# Altium schematic sheet MCU, Relays & USB.SchDoc
size A4; SheetNumber: 4; SheetTotal: 4
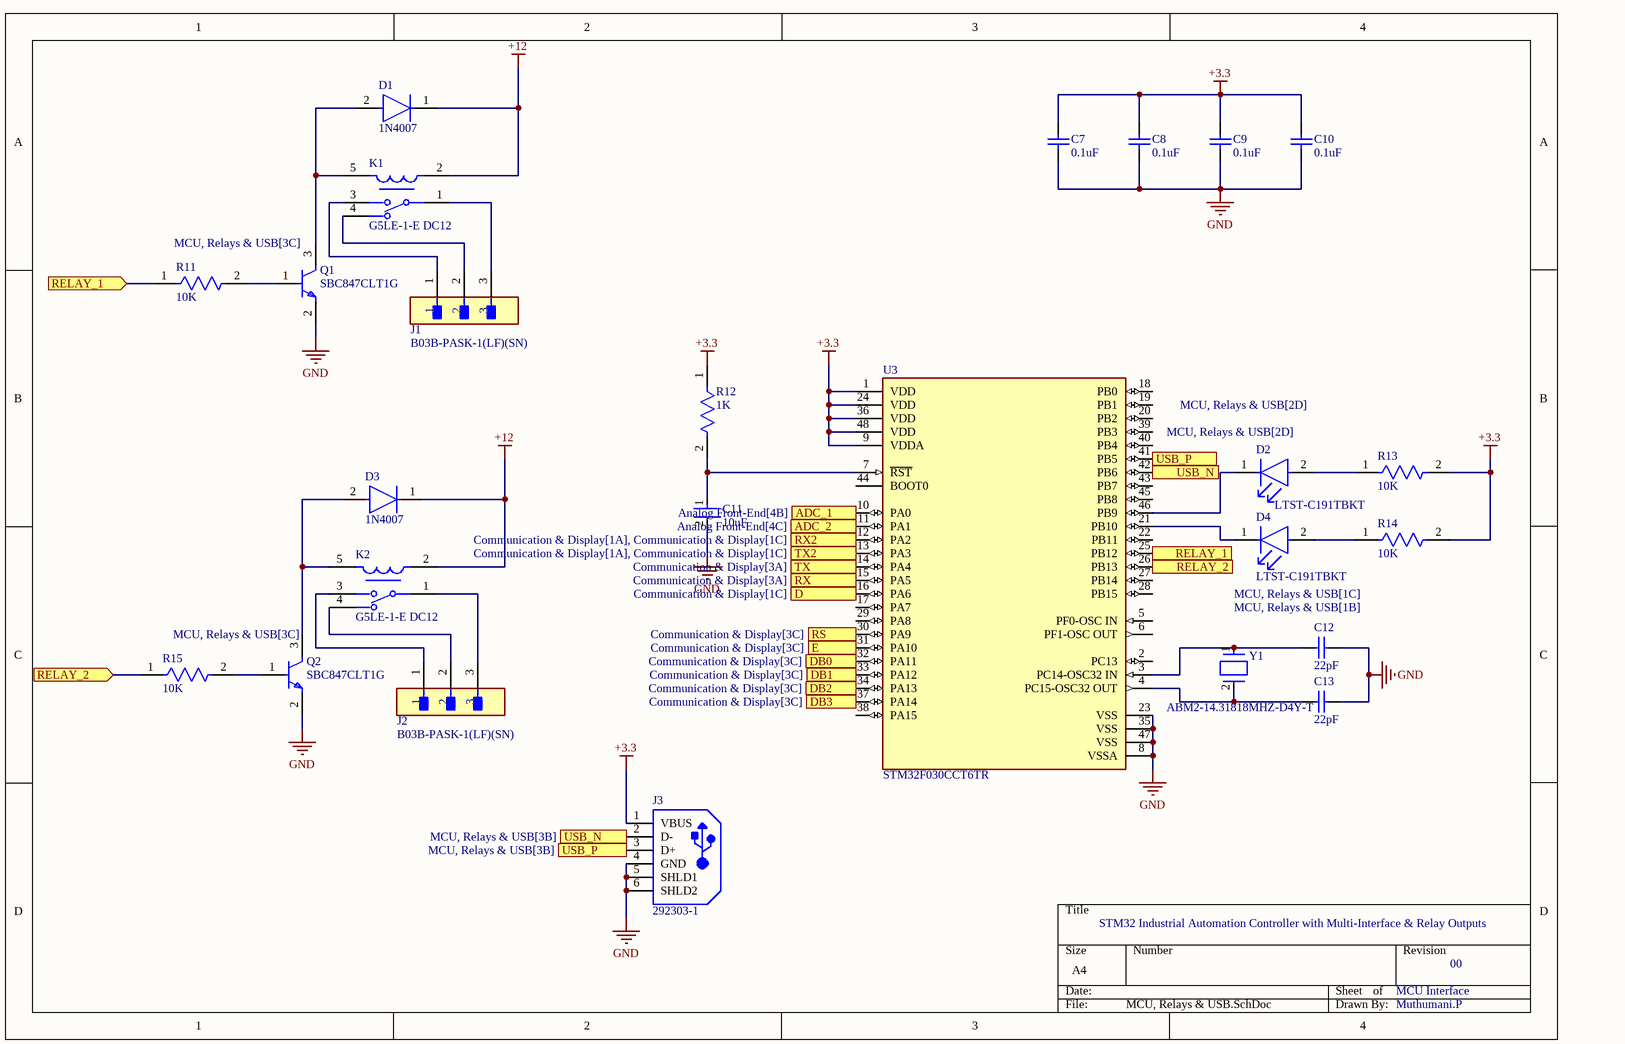
[diagram p0: MCU, Relays & USB.SchDoc]

## Parts
C7  0.1uF  [CAPC1608X90X35ML10T15]
C8  0.1uF  [CAPC1608X90X35ML10T15]
C9  0.1uF  [CAPC1608X90X35ML10T15]
C10  0.1uF  [CAPC1608X90X35ML10T15]
C11  10uF  [FP-GRM18-0_15-MFG]
C12  22pF  [CAPC1608X90X35ML10T15]
C13  22pF  [CAPC1608X90X35ML10T15]
D1  1N4007  [FP-1N4007-MFG]
D2  LTST-C191TBKT  [FP-LTST-C191TBKT-MFG]
D3  1N4007  [FP-1N4007-MFG]
D4  LTST-C191TBKT  [FP-LTST-C191TBKT-MFG]
J1  B03B-PASK-1(LF)(SN)  [FP-B03B-PASK-1_LF_SN-MFG]
J2  B03B-PASK-1(LF)(SN)  [FP-B03B-PASK-1_LF_SN-MFG]
J3  292303-1  [TE-292303-1_V]
K1  G5LE-1-E DC12  [FP-G5LE-1-E_DC12-MFG]
K2  G5LE-1-E DC12  [FP-G5LE-1-E_DC12-MFG]
Q1  SBC847CLT1G  [FP-318-08-MFG]
Q2  SBC847CLT1G  [FP-318-08-MFG]
R11  10K  [FP-RC0603-0_55-IPC_C]
R12  1K  [FP-RC0603-0_55-IPC_C]
R13  10K  [FP-RC0603-0_55-IPC_C]
R14  10K  [FP-RC0603-0_55-IPC_C]
R15  10K  [FP-RC0603-0_55-IPC_C]
U3  STM32F030CCT6TR  [FP-LQFP48-5B-IPC_A]
Y1  ABM2-14.31818MHZ-D4Y-T  [FP-ABM2-MFG]

## Ports
ADC_1 (in, see Analog Front-End[4B]), ADC_2 (in, see Analog Front-End[4C]), D (in, see Communication & Display[1C]), DB0 (see Communication & Display[3C]), DB1 (see Communication & Display[3C]), DB2 (see Communication & Display[3C]), DB3 (see Communication & Display[3C]), E (see Communication & Display[3C]), RELAY_1 (in, see MCU, Relays & USB[3C]), RELAY_1 (out, see MCU, Relays & USB[1B]), RELAY_2 (in, see MCU, Relays & USB[3C]), RELAY_2 (out, see MCU, Relays & USB[1C]), RS (see Communication & Display[3C]), RX2 (in, see Communication & Display[1A], Communication & Display[1C]), RX (in, see Communication & Display[3A]), TX2 (in, see Communication & Display[1A], Communication & Display[1C]), TX (in, see Communication & Display[3A]), USB_N (out, see MCU, Relays & USB[2D]), USB_N (out, see MCU, Relays & USB[3B]), USB_P (out, see MCU, Relays & USB[2D]), USB_P (out, see MCU, Relays & USB[3B])

## Nets
+3.3: C7.1 C8.1 C9.1 C10.1 J3.1(VBUS) R12.1 R13.2 R14.2 U3.1(VDD) U3.9(VDDA) U3.24(VDD) U3.36(VDD) U3.48(VDD)
+12: D1.1(C) D3.1(C) K1.2 K2.2
GND: C7.2 C8.2 C9.2 C10.2 C11.2 C12.2 C13.2 J3.4(GND) J3.5(SHLD1) J3.6(SHLD2) Q1.2(E) Q2.2(E) U3.8(VSSA) U3.23(VSS) U3.35(VSS) U3.47(VSS)
ADC_1: U3.10(PA0) ; port ADC_1
ADC_2: U3.11(PA1) ; port ADC_2
D: U3.16(PA6) ; port D
DB0: U3.32(PA11) ; port DB0
DB1: U3.33(PA12) ; port DB1
DB2: U3.34(PA13) ; port DB2
DB3: U3.37(PA14) ; port DB3
E: U3.31(PA10) ; port E
RELAY_1: R11.1 U3.25(PB12) ; port RELAY_1
RELAY_2: R15.1 U3.26(PB13) ; port RELAY_2
RS: U3.30(PA9) ; port RS
RX: U3.15(PA5) ; port RX
RX2: U3.12(PA2) ; port RX2
TX: U3.14(PA4) ; port TX
TX2: U3.13(PA3) ; port TX2
USB_N: J3.2(D-) U3.42(PB6) ; port USB_N
USB_P: J3.3(D+) U3.41(PB5) ; port USB_P
NetC11_1: C11.1 R12.2 U3.7(~{RST})
NetC12_1: C12.1 U3.3(PC14-OSC32_IN) Y1.1
NetC13_1: C13.1 U3.4(PC15-OSC32_OUT) Y1.2
NetD1_2: D1.2(A) K1.5 Q1.3(C)
NetD2_1: D2.1(C) U3.46(PB9)
NetD2_2: D2.2(A) R13.1
NetD3_2: D3.2(A) K2.5 Q2.3(C)
NetD4_1: D4.1(C) U3.21(PB10)
NetD4_2: D4.2(A) R14.1
NetJ1_1: J1.1 K1.3
NetJ1_2: J1.2 K1.4
NetJ1_3: J1.3 K1.1
NetJ2_1: J2.1 K2.3
NetJ2_2: J2.2 K2.4
NetJ2_3: J2.3 K2.1
NetQ1_1: Q1.1(B) R11.2
NetQ2_1: Q2.1(B) R15.2

Not connected (* = marked no-connect by the designer): U3 2(PC13) 5(PF0-OSC_IN) 6(PF1-OSC_OUT) 17(PA7) 18(PB0) 19(PB1) 20(PB2) 22(PB11) 27(PB14) 28(PB15) 29(PA8) 38(PA15) 39(PB3) 40(PB4) 43(PB7) 44(BOOT0) 45(PB8)

## Notes on the sheet
- STM32 Industrial Automation Controller with Multi-Interface & Relay Outputs
- MCU Interface
- 00
- Muthumani.P

## Library data of the parts
C7-C10 = CMP-2100-03643-1: Chip Capacitor, 0.1 uF, +/- 10%, 50 V, -55 to 125 degC, 0603 (1608 Metric), RoHS, Tape and Reel; Manufacturer: Murata; Dielectric Material: Ceramic; Voltage Rating: 50V; Capacitance: 100nF; Dielectric: X7R; Insulation Resistance: 10GR; Case Code (Metric): 1608; Lead Free: LeadFree; Depth: 0.8mm; Number of Pins: 2; Radiation Hardening: No; Case/Package: 0603; Manufacturer URL: http://www.murata.com/; Packaging: TapeandReel; Length: 1.6mm; Contact Plating: Tin; Datasheet URL: http://psearch.en.murata.com/capacitor/product/GRM188R71H104KA93%23.pdf; Tolerance: 10%; Case Code (Imperial): 0603; Min Operating Temperature: -55degC; RoHSCompliant: true; Voltage: 50V; Termination: SMD/SMT; Mount: SurfaceMount; Material: Ceramic; Package Quantity: 1; Height: 0.8mm; Thickness: 0.035inch; REACH SVHC: NoSVHC; Max Operating Temperature: 125degC; Width: 0.8mm; Package Reference: 0603; Voltage Rating (DC): 50V; Datasheet Version: 42675.0; Package Description: 2-Pin Surface Mount Device, Body 1.6 x 0.8 mm
C11 = CMP-2000-05448-2: CAP CER 10UF 10V X5R 0603; Manufacturer Part Number: GRM188R61A106KE69D; Manufacturer: Murata; Temperature Coefficient: 15%; Material: Ceramic; Tolerance: 10%; Device Class L1: Passive Components; ComponentLink2Description: Datasheet; Height: 0.95mm; Package: GRM18-0.15; Octopart: https://octopart.com/grm188r61a106ke69d-murata-22851381; Value: 10uF; Digikey Description: CAP CER 10UF 10V X5R 0603; Temperature Range High: +85°C; Temperature Range Low: -55°C; Temperature Characteristic: X5R; Capacitance: 10uF; RoHS: TRUE; Device Class L2: Capacitors; ComponentLink2URL: https://search.murata.co.jp/Ceramy/image/img/A01X/G101/ENG/GRM188R61A106KE69-01A.pdf; Device Class L3: Ceramic Capacitors; Lead Free: Yes; Mouser Description: Multilayer Ceramic Capacitors MLCC - SMD/SMT 0603 10uF 10volts X5R + - 10%; Category: Cap; Voltage Rating: 10V; Temperature: -55°C to +85°C; Automotive: No
C12 C13 = CMP-2000-04945-1: Chip Capacitor, 22 pF, +/- 5%, 50 V, -55 to 125 degC, 0603 (1608 Metric), RoHS, Tape and Reel; Manufacturer: Murata; Rated Voltage: 50V; Dielectric: C0G; Capacitance: 22pF; Manufacturer URL: http://www.murata.com/; Datasheet Version: Jul-06; Package Reference: 603; Tolerance (%): ±5%; Case Size/Dimension: 0603; Package Description: 2-Pin Surface Mount Device, Body 1.6 x 0.8 mm; Datasheet URL: https://datasheet.ciiva.com/11786/0900766b807a1cab-11786398.pdf
D1 D3 = CMP-123542-000001-1: Rectifier diode 1000 V 1 A DO-41, ,; Manufacturer: Diotec; Max Surge Forward Current: 27A; Forward Current: 1A; Max Junction Temp: +175°C; Reverse Voltage: 1000V; Value: 15pF; Peak Reverse Current: 5uA; Category: Diode; Temperature Range Low: -50°C; Automotive: No; Temperature: -50°C to +175°C; Lead Free: Yes; ComponentLink2Description: Datasheet; Max Repetitive Reverse Voltage: 1000V; ComponentLink2URL: https://datasheet.octopart.com/1N4007-Diotec-datasheet-62346875.pdf; Manufacturer Part Number: 1N4007; Device Class L3: Rectifier Diodes; Height: 2.8mm; Octopart: https://octopart.com/1n4007-diotec-4040411; Package: 1N4007; Temperature Range High: +175°C; Device Class L1: Discrete Semiconductors; Device Class L2: Diodes; RoHS: TRUE; Capacitance: 15pF; Ipc Land Pattern Name: DIOAD888W100L520D280
D2 D4 = CMP-22017-000008-1: LED BLUE CLEAR CHIP SMD; Lens Color: Colorless; Dominant Wavelength: 475nm; Forward Current: 20mA; Wavelength: 468nm; Viewing Angle: 130°; Power Dissipation: 76mW; Luminous Intensity: 180mcd; Reverse Voltage: 5V; Number of Elements: 1; Lens Style: Diffused; Forward Voltage: 3.8V; Max Power Dissipation: 75mW; Case Code (Metric): 1608; Packaging: Tape and Reel; Case/Package: 0603; Depth: 1.6mm; Mount: Surface Mount; Lead Free: Lead Free; Min Operating Temperature: -20°C; Lens Transparency: Clear; Illumination Color: Blue; Height: 0.55mm; Test Current: 20mA; Case Code (Imperial): 0603; Max Operating Temperature: 80°C; Number of Pins: 2; Length: 0.8mm; Radiation Hardening: No; Package Quantity: 1; Number of LEDs: 1; Width: 0.8mm; Color: Blue
J1 J2 = CMP-17439-000193-1: CONN HEADER VERT 3POS 2MM; Voltage Rating: 250V; Current Rating: 3A; Mated Stacking Heights: 14.9mm; Number of Positions: 3; Packaging: Bulk; Contact Type: Male Pin; Flammability Rating: UL94 V-0; Contact Shape: Square; Number of Rows: 1; Color: Natural; Orientation: Straight; Housing Color: White; Fastening Type: Ramp; Insulation Material: PBT; Insulation Color: Natural; Mount: Through Hole; Contact Finish - Mating: TIN; Connector Type: Header; Termination: Solder; Contact Mating Length: 0.126inch; Lead Free: Lead Free; Contact Material: Copper Alloy; Pitch: 2mm; Series: PA; Number of Contacts: 3; Contact Plating: Tin
J3 = CMP-2000-05404-1: 1 Port Right Angle Through Hole Mount Female Type A USB Connector, 4 Position, -55 to 85 degC, RoHS, Tube; Manufacturer: TE Connectivity; Contact Termination Type: Solder; No. of Contacts: 4; Connector Mounting: PCB; SVHC: NoSVHC(16-Jun-2014); Gender: Receptacle; Connector Type: USBA; Package Description: 4-Pin Through Hole Device, Body 14 x 13.13 mm, Pitch 2.5 mm; Contact Plating: Gold; Package Reference: 292303-1; Contact Material: Copper; Datasheet URL: http://www.farnell.com/cad/1653030.pdf; Datasheet Version: Feb-12; Manufacturer URL: http://www.te.com/
K1 K2 = CMP-08822-000240-1: RELAY GEN PURPOSE SPDT 16A 12V; Voltage Rating (AC): 250V; Coil Type: Non-Latching; Release Time: 5ms; Relay Type: General Purpose; Power Consumption: 400mW; Coil Current: 33.3mA; Application(s): POWER; Coil Resistance: 360R; Life (Hours): 1000000Hour; Operate Time: 10ms; Contact Material: Tin; Number of Pins: 5; Min Operating Temperature: -40°C; Width: 16.5mm; Weight: 12g; Mount: Through Hole; Contact Current Rating: 16A; Series: G5LE-E; Termination: Solder; Coil Voltage (DC): 12V; Height: 19mm; Max Operating Temperature: 85°C; Depth: 16.5mm; Length: 22.5mm; Packaging: Tray; Max Voltage Rating (AC): 250V; Package Quantity: 100; Coil Power: 400mW; Throw Configuration: SPDT; Lead Free: Lead Free; Max Current Rating: 16A
Q1 Q2 = CMP-1048-00766-2: Manufacturer Lifecycle Status: ACTIVE; NexarPartId: 22133919; Max Frequency: 100MHz; hFE Min: 420; Collector Base Voltage (VCBO): 50V; Power Dissipation: 225mW; Max Junction Temperature (Tj): 150°C; Max Breakdown Voltage: 45V; Collector Emitter Saturation Voltage: 600mV; Max Power Dissipation: 300mW; Polarity: NPN; Max Collector Current: 100mA; Number of Elements: 1; Emitter Base Voltage (VEBO): 6V; Element Configuration: Single; Gain Bandwidth Product: 100MHz; Case/Package: SOT-23-3; Height: 1.01mm; Number of Pins: 3; Max Operating Temperature: 150°C; Min Operating Temperature: -55°C; Schedule B: 8541210080, 8541210080; Transition Frequency: 100MHz; Collector Emitter Breakdown Voltage: 45V; Length: 3.04mm; Continuous Collector Current: 100mA; Packaging: Tape & Reel; Frequency: 100MHz; Width: 1.4mm; Lead Free: Lead Free; Lifecycle Status: Production; RoHS: Compliant; Halogen Free: Halogen Free; Radiation Hardening: No; Collector Emitter Voltage (VCEO): 45V
R11 R13-R15 = CMP-2100-03664-2: RES 10K OHM 1% 1/10W 0603; Voltage Rating: 75V; Voltage Rating (DC): 50V; Resistance: 10kR; Power Rating: 100mW; Temperature Coefficient: 100ppm/°C; Depth: 0.8mm; Termination: SMD/SMT; Resistor Type: Thick Film; Series: RC; Construction: Rectangular; Features: Moisture Resistant; Packaging: Tape and Reel; Min Operating Temperature: -55°C; Number of Terminations: 2; Lead Pitch: 0.3mm; RoHS Compliant: Yes; Case/Package: 0603; Resistance Tolerance: 1%; Military Standard: Not; Weight: 7.1E-05oz; Number of Pins: 2; Tolerance: 1%; Length: 1.6mm; Case Code (Imperial): 0603; Lead Free: Lead Free; Width: 0.8mm; Max Power Dissipation: 100mW; Height: 0.45mm; Max Operating Temperature: 155°C; Case Code (Metric): 1608; Size Code: 0603
R12 = CMP-1659-00009-5: RES 1K OHM 1% 1/10W 0603; Resistance: 1kR; Voltage Rating: 50V; Power Rating: 100mW; Temperature Coefficient: 100ppm/°C; Military Standard: Not; REACH SVHC: No SVHC; Size Code: 0603; Features: Moisture Resistant; Number of Terminations: 2; Technology: THICK FILM; Series: RC; Case Code (Metric): 1608; Resistance Tolerance: 1%; Resistor Type: Thick Film; Termination: SMD/SMT; Contact Plating: Tin; Radiation Hardening: No; Min Operating Temperature: -55°C; Max Operating Temperature: 155°C; Packaging: Tape and Reel; Max Power Dissipation: 100mW; RoHS Compliant: Yes; Height: 0.45mm; Lead Free: Lead Free; Case/Package: 0603; Length: 1.6mm; Tolerance: 1%; Case Code (Imperial): 0603; Construction: Rectangular; Depth: 0.8mm
U3 = CMP-12105-000129-1: IC MCU 32BIT 256KB FLASH 48LQFP; Core Architecture: ARM; Peripherals: POR; Interface: I2C; Frequency: 48MHz; Oscillator Type: Internal; Number of I/Os: 39; Packaging: Cut Tape; Memory Size: 256KB; RoHS Compliant: Yes; Min Operating Temperature: -40°C; Case/Package: LQFP; Max Operating Temperature: 85°C; Number of Pins: 48; Memory Type: FLASH
Y1 = CMP-27762-013666-1: Crystal 14.31818MHz ±30ppm 18pF SMD-2 8mm x 4.5mm; ESR (Equivalent Series Resistance): 60R; Height: 0.063inch; Case/Package: CSMD; Width: 0.177inch; Load Capacitance: 18pF; Frequency Tolerance: 30ppm; Termination: SMD/SMT; Tolerance: 30ppm; Number of Pins: 2; Max Operating Temperature: 85°C; Series: ABM2; Frequency: 14.31818MHz; Mount: Surface Mount; Length: 8mm; Resistor Type: Ceramic; Package Quantity: 1000; Depth: 4.5mm; Min Operating Temperature: -40°C; Radiation Hardening: No; Frequency Stability: 30ppm; Packaging: Tape and Reel